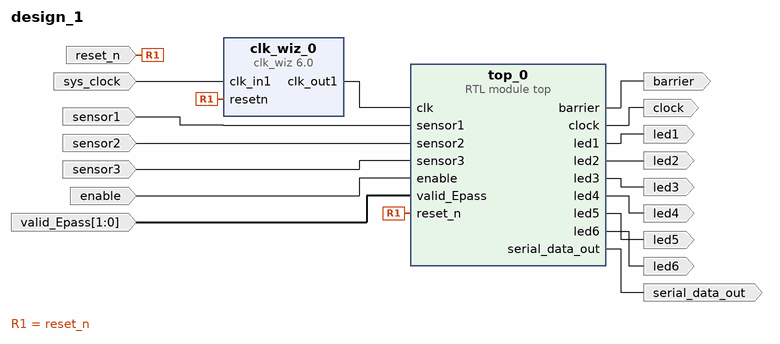
[diagram p0: block diagram of the top level]
# Vivado block design design_1, xc7z020clg484-1, Vivado 2018.3
create_bd_design design_1

create_bd_port -dir I -type rst reset_n
create_bd_port -dir I sensor1
create_bd_port -dir I sensor2
create_bd_port -dir I sensor3
create_bd_port -dir I enable
create_bd_port -dir O barrier
create_bd_port -dir O serial_data_out
create_bd_port -dir I -type clk sys_clock
create_bd_port -dir I -from 1 -to 0 valid_Epass
create_bd_port -dir O led1
create_bd_port -dir O led2
create_bd_port -dir O led3
create_bd_port -dir O led4
create_bd_port -dir O led5
create_bd_port -dir O led6
create_bd_port -dir O -type clk clock

create_bd_cell -type module -reference top top_0
create_bd_cell -type ip -vlnv xilinx.com:ip:clk_wiz:6.0 clk_wiz_0
set_property -dict [list \
  CONFIG.CLKOUT1_JITTER 290.478 \
  CONFIG.CLKOUT1_PHASE_ERROR 133.882 \
  CONFIG.CLKOUT1_REQUESTED_OUT_FREQ 10.000 \
  CONFIG.MMCM_CLKFBOUT_MULT_F 15.625 \
  CONFIG.MMCM_CLKOUT0_DIVIDE_F 78.125 \
  CONFIG.MMCM_DIVCLK_DIVIDE 2 \
  CONFIG.RESET_PORT resetn \
  CONFIG.RESET_TYPE ACTIVE_LOW \
] [get_bd_cells clk_wiz_0]

# ---- connections ----

connect_bd_net [get_bd_ports reset_n] [get_bd_pins top_0/reset_n] [get_bd_pins clk_wiz_0/resetn]
connect_bd_net -net sensor1_1 [get_bd_ports sensor1] [get_bd_pins top_0/sensor1]
connect_bd_net -net sensor2_1 [get_bd_ports sensor2] [get_bd_pins top_0/sensor2]
connect_bd_net -net sensor3_1 [get_bd_ports sensor3] [get_bd_pins top_0/sensor3]
connect_bd_net [get_bd_ports enable] [get_bd_pins top_0/enable]
connect_bd_net [get_bd_pins top_0/barrier] [get_bd_ports barrier]
connect_bd_net [get_bd_pins top_0/serial_data_out] [get_bd_ports serial_data_out]
connect_bd_net [get_bd_pins clk_wiz_0/clk_out1] [get_bd_pins top_0/clk]
connect_bd_net -net clk_in1_0_1 [get_bd_ports sys_clock] [get_bd_pins clk_wiz_0/clk_in1]
connect_bd_net [get_bd_ports valid_Epass] [get_bd_pins top_0/valid_Epass]
connect_bd_net [get_bd_pins top_0/led1] [get_bd_ports led1]
connect_bd_net [get_bd_pins top_0/led2] [get_bd_ports led2]
connect_bd_net [get_bd_pins top_0/led3] [get_bd_ports led3]
connect_bd_net [get_bd_pins top_0/led4] [get_bd_ports led4]
connect_bd_net [get_bd_pins top_0/led5] [get_bd_ports led5]
connect_bd_net [get_bd_pins top_0/led6] [get_bd_ports led6]
connect_bd_net [get_bd_pins top_0/clock] [get_bd_ports clock]

validate_bd_design
save_bd_design
